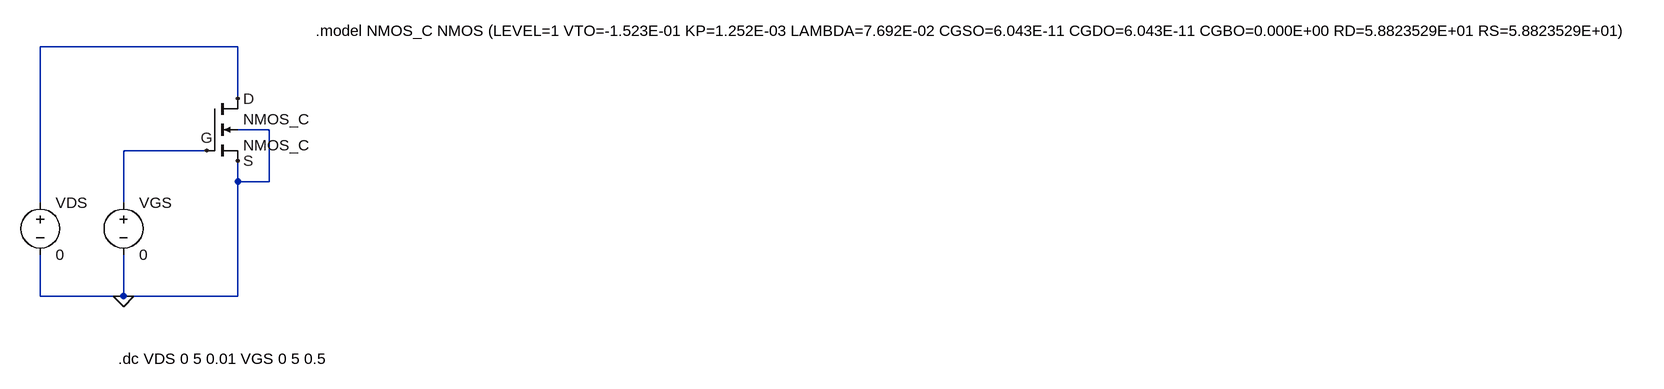
[diagram p0: schematic Validation_NMOS.asc]
Validation_NMOS.asc, the LTspice schematic file:
Version 4.1
SHEET 1 2456 680
WIRE 192 160 -112 160
WIRE 192 240 192 160
WIRE 240 288 192 288
WIRE 144 320 16 320
WIRE 192 368 192 336
WIRE 240 368 240 288
WIRE 240 368 192 368
WIRE -112 400 -112 160
WIRE 16 400 16 320
WIRE -112 544 -112 480
WIRE 16 544 16 480
WIRE 16 544 -112 544
WIRE 192 544 192 368
WIRE 192 544 16 544
FLAG 192 240 D
FLAG 144 320 G
FLAG 192 336 S
FLAG 16 544 0
SYMBOL nmos4 144 240 R0
SYMATTR InstName NMOS_C
SYMATTR Value NMOS_C
SYMATTR Value2 l=65n w=200n
SYMBOL voltage -112 384 R0
WINDOW 123 0 0 Left 0
WINDOW 39 0 0 Left 0
SYMATTR InstName VDS
SYMATTR Value 0
SYMBOL voltage 16 384 R0
WINDOW 123 0 0 Left 0
WINDOW 39 0 0 Left 0
SYMATTR InstName VGS
SYMATTR Value 0
TEXT 312 136 Left 2 !.model NMOS_C NMOS (LEVEL=1 VTO=-1.523E-01 KP=1.252E-03 LAMBDA=7.692E-02 CGSO=6.043E-11 CGDO=6.043E-11 CGBO=0.000E+00 RD=5.8823529E+01 RS=5.8823529E+01)
TEXT 8 640 Left 2 !.dc VDS 0 5 0.01 VGS 0 5 0.5

The netlist it stands for:
* Validation_NMOS.asc
M§NMOS_C D G 0 0 NMOS_C l=65n w=200n
VDS D 0 0
VGS G 0 0
.model NMOS NMOS
.model PMOS PMOS
.lib standard.mos
.model NMOS_C NMOS (LEVEL=1 VTO=-1.523E-01 KP=1.252E-03 LAMBDA=7.692E-02 CGSO=6.043E-11 CGDO=6.043E-11 CGBO=0.000E+00 RD=5.8823529E+01 RS=5.8823529E+01)
.dc VDS 0 5 0.01 VGS 0 5 0.5
.backanno
.end